# EasyEDA Pro project ProProject_Paragliding-Sensor_2023-10-07.epro

# Schematic Schematic
Create Date: 2023-07-27; Page Name: Ext. Sensor; Project Name: Paragliding-Sensor; Schematic Name: Schematic; Update Date: 2023-09-18; Company: 嘉立创EDA; Page Size: A4; Version: V1.0
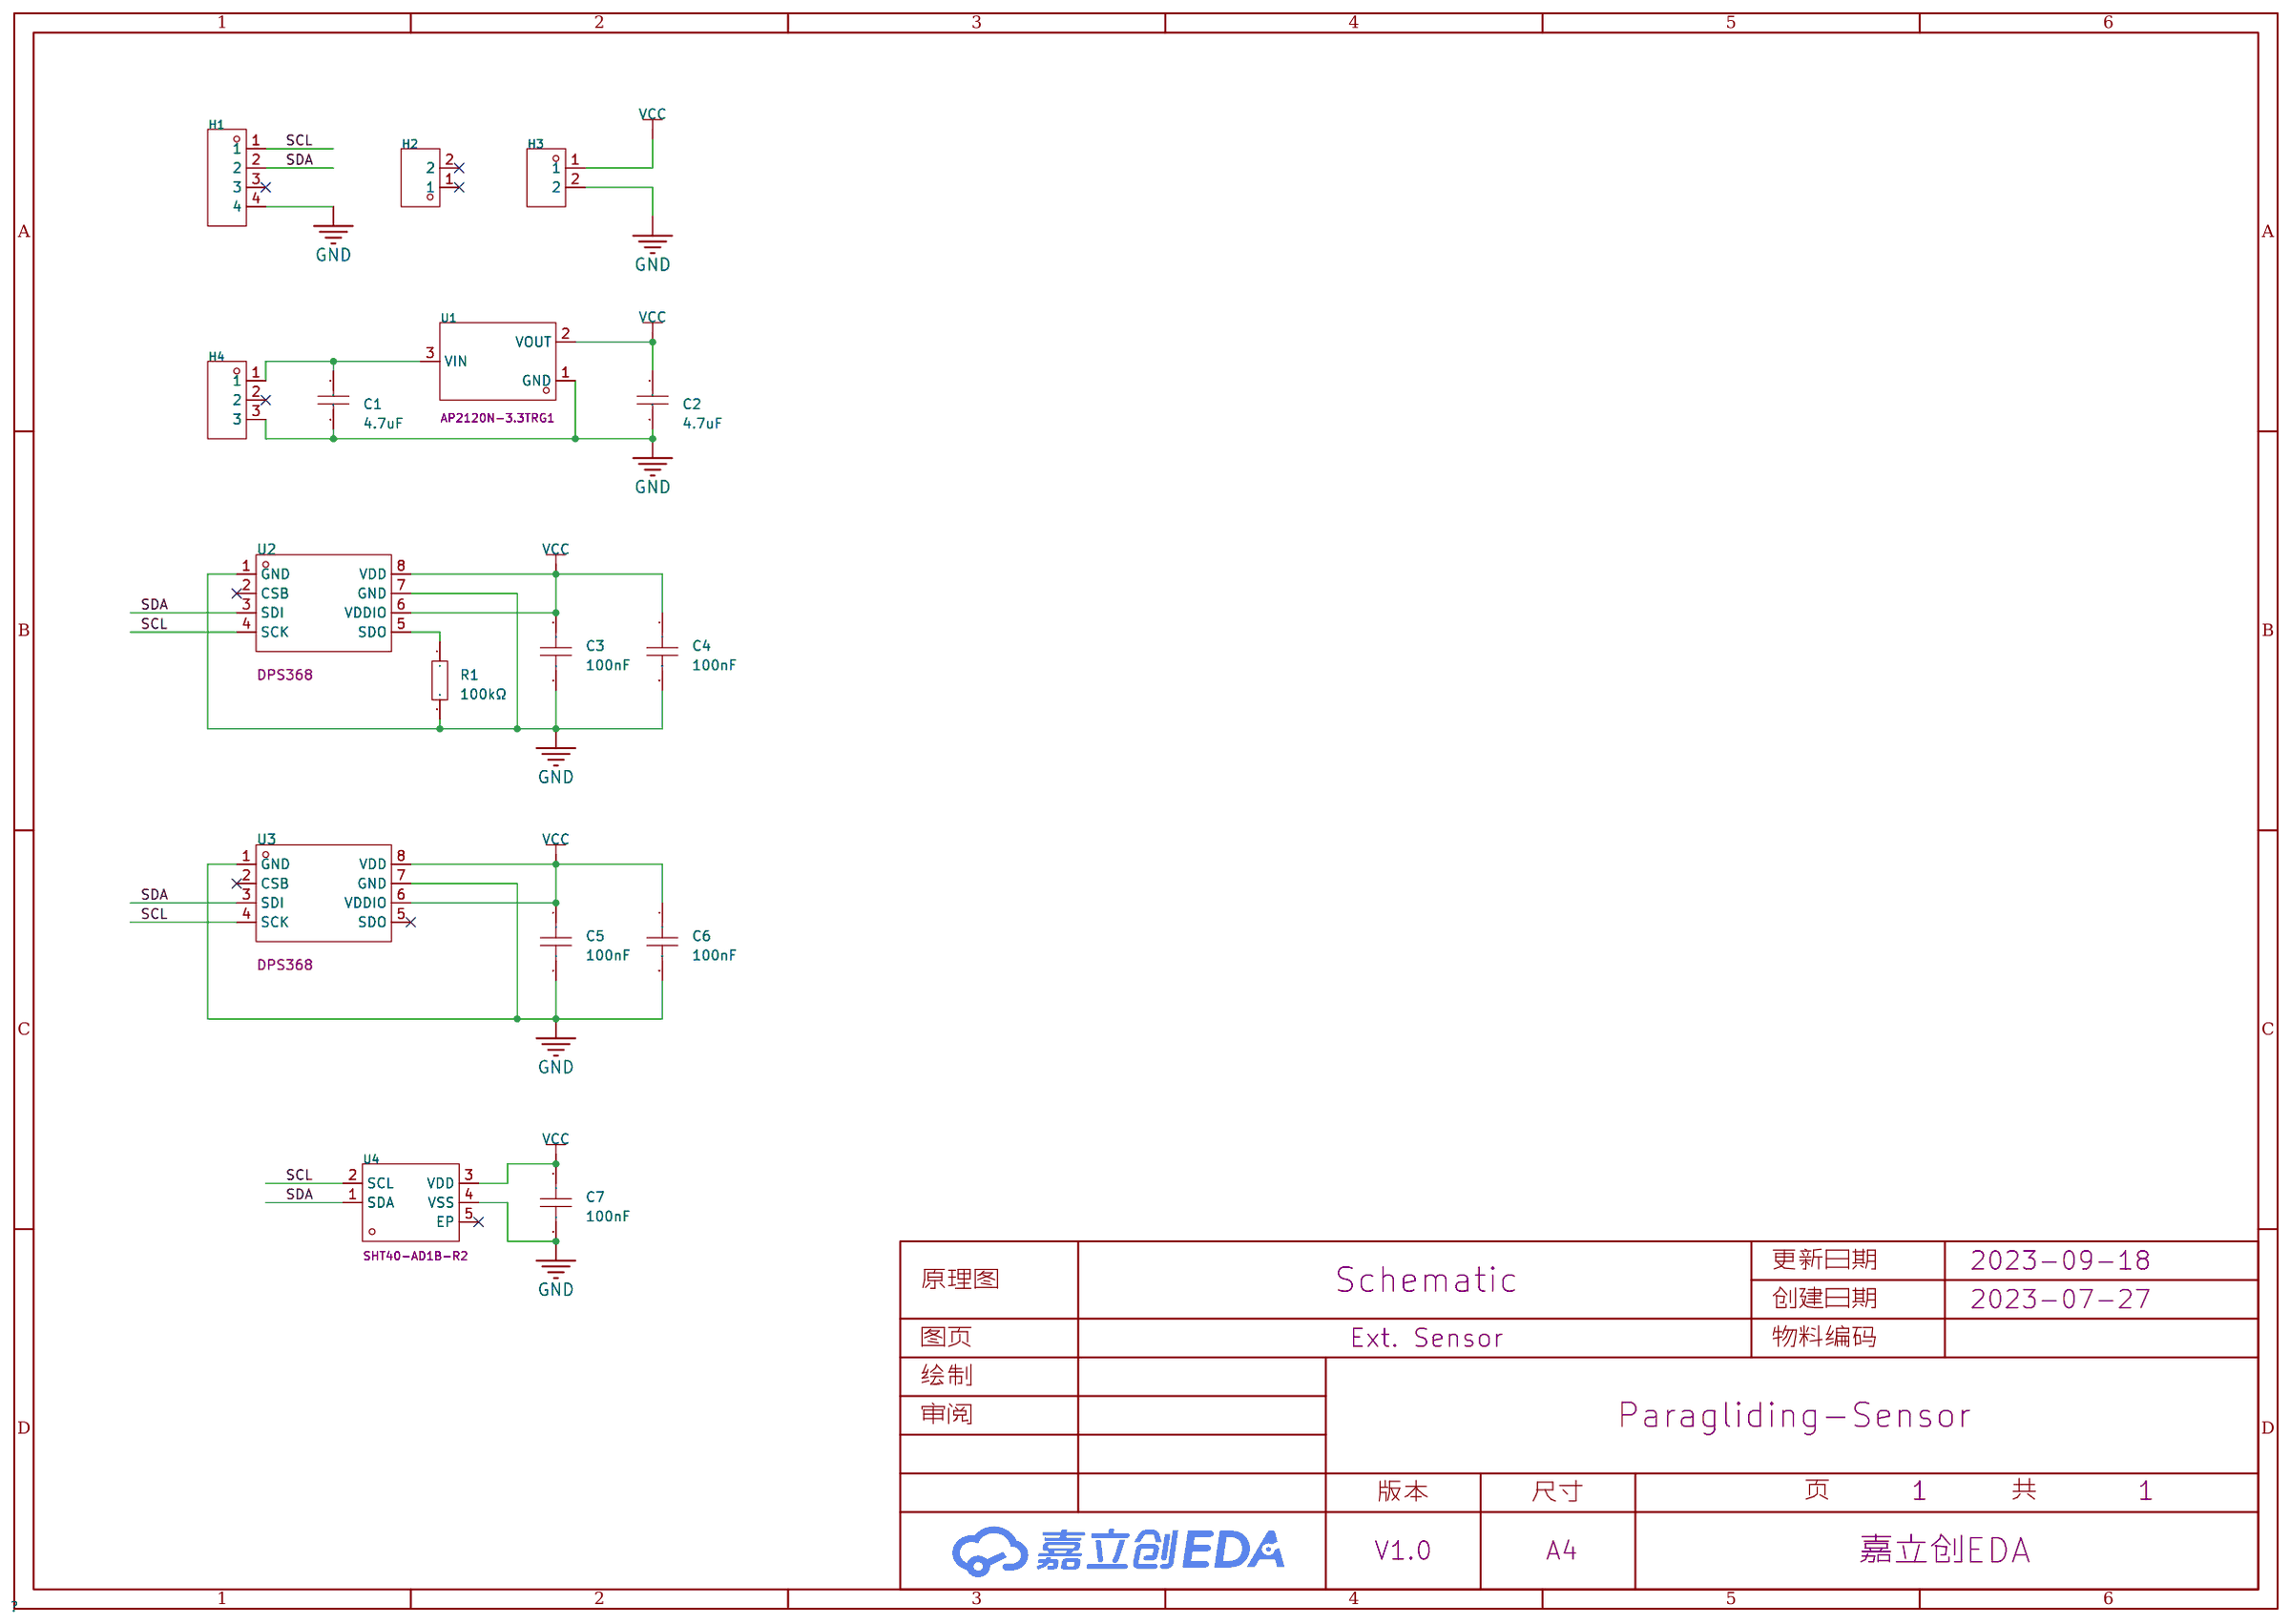
[diagram p0: schematic sheet]

## Parts
C1  4.7uF  [C0402]
C2  4.7uF  [C0402]
C3  100nF  [C0201]
C4  100nF  [C0201]
C5  100nF  [C0201]
C6  100nF  [C0201]
C7  100nF  [C0201]
H1  PZ254V-11-04P  [HDR-TH_4P-P2.54-V-M]
H2  PZ254V-11-02P  [HDR-TH_2P-P2.54-V-M]
H3  PZ254V-11-02P  [HDR-TH_2P-P2.54-V-M]
H4  PZ254V-11-03P  [HDR-TH_3P-P2.54-V-M]
R1  100kΩ  [R0201]
U1  AP2120N-3.3TRG1  [SOT-23-3_L2.9-W1.3-P1.90-LS2.4-BR]
U2  DPS368  [WLGA-8_L2.5-W2.0-P0.65-TR_DPS422]
U3  DPS368  [WLGA-8_L2.5-W2.0-P0.65-TR_DPS422]
U4  SHT40-AD1B-R2  [DFN-4_L1.5-W1.5-P0.8-TL-EP]

## Library data of the parts
C1 C2 = CL05A475MP5NRNC: 容值:4.7uF;精度:±20%;额定电压:10V;材质(温度系数):X5R;; LCSC Part Name: 4.7uF ±20% 10V; Supplier Part: C23733; Manufacturer: SAMSUNG(三星); Supplier Footprint: 0402; JLCPCB Part Class: 基础库; Datasheet: https://atta.szlcsc.com/upload/public/pdf/source/20160103/1457707710457.pdf; Supplier: LCSC; Tolerance: ±20%; Voltage Rated: 10V; Temperature Coefficient: X5R
C3-C7 = GRM033Z71A104KE14D: 容值:100nF;精度:±10%;额定电压:10V;材质(温度系数):X7R;; LCSC Part Name: 100nF ±10% 10V; Supplier Part: C161494; Manufacturer: muRata(村田); Supplier Footprint: 0201; JLCPCB Part Class: 扩展库; Datasheet: https://atta.szlcsc.com/upload/public/pdf/source/20181119/C161494_7C14CD1E604AF2690E90D16E0278156D.pdf; Supplier: LCSC; Tolerance: ±10%; Voltage Rated: 10V; Temperature Coefficient: X7R
H1 = PZ254V-11-04P: 排数:单排;总PIN位数:4P;间距:2.54mm;插针结构:1x4P;行距:-;安装类型:直插;圆针/方针:方针;额定电流:3A;额定电压:250V;配合针长度:6mm;塑高:2.5mm;端接针长度:3mm;触头材质:-;工作温度范围:-40℃~+105℃;颜色:黑色;; LCSC Part Name: 2.54mm 1x4P 直插 方针; Supplier Part: C2691448; Manufacturer: XFCN(兴飞); Supplier Footprint: 插件,P=2.54mm; JLCPCB Part Class: 扩展库; Datasheet: https://atta.szlcsc.com/upload/public/pdf/source/20200309/C492403_F9F19131791D08044AD4F84F8E751A34.pdf; Supplier: LCSC; Number of Rows: 单排; Number of Pins: 4P; Pitch: 2.54mm; Pin Structure: 1x4P; Mounting Type: 直插; Circluar Pins/Square Pins: 方针; Current Rating (Max): 3A; Voltage Rating (Max): 250V; Length of Mating Pin: 6mm; Insulation Height: 2.5mm; Length of End Connection Pin: 3mm; Operating Temperature Range: -40℃~+105℃; Color: 黑色
H2 H3 = PZ254V-11-02P: 排数:单排;总PIN位数:2P;间距:2.54mm;插针结构:1x2P;行距:-;安装类型:直插;圆针/方针:方针;额定电流:-;额定电压:-;配合针长度:6mm;塑高:2.5mm;端接针长度:3mm;触头材质:黄铜;触头镀层:-;工作温度范围:-40℃~+105℃;颜色:黑色;; LCSC Part Name: 2.54mm 1x2P 直插 方针; Supplier Part: C492401; Manufacturer: XFCN(兴飞); Supplier Footprint: 插件,P=2.54mm; JLCPCB Part Class: 扩展库; Datasheet: https://atta.szlcsc.com/upload/public/pdf/source/20200309/C492401_A812433581A9B211A7FFA413ADDFF0E5.pdf; Supplier: LCSC; Number of Rows: 单排; Number of Pins: 2P; Pitch: 2.54mm; Pin Structure: 1x2P; Mounting Type: 直插; Circluar Pins/Square Pins: 方针; Length of Mating Pin: 6mm; Insulation Height: 2.5mm; Length of End Connection Pin: 3mm; Contact Material: 黄铜; Operating Temperature Range: -40℃~+105℃; Color: 黑色
H4 = PZ254V-11-03P: 排数:单排;总PIN位数:3;间距:2.54mm;插针结构:1x3P;行距:-;安装类型:直插;圆针/方针:方针;额定电流:3A;额定电压:250V;配合针长度:6mm;塑高:2.5mm;端接针长度:3mm;工作温度范围:-40℃~+105℃;颜色:黑色;; LCSC Part Name: 2.54mm 1x3P 直插 方针; Supplier Part: C2937625; Manufacturer: XFCN(兴飞); Supplier Footprint: 直插,P=2.54mm; JLCPCB Part Class: 扩展库; Datasheet: 2022-07-12/581362A/62b9d00620994b3696be7eb4af85ad72/双排排针和单排排针.pdf; Supplier: LCSC; Number of Rows: 单排; Number of Pins: 3; Pitch: 2.54mm; Pin Structure: 1x3P; Mounting Type: 直插; Circluar Pins/Square Pins: 方针; Current Rating (Max): 3A; Voltage Rating (Max): 250V; Length of Mating Pin: 6mm; Insulation Height: 2.5mm; Length of End Connection Pin: 3mm; Operating Temperature Range: -40℃~+105℃; Color: 黑色
R1 = 0201WMF1003TEE: 电阻类型:厚膜电阻;阻值:100kΩ;精度:±1%;功率:50mW;; LCSC Part Name: 100kΩ ±1% 50mW; Supplier Part: C270364; Manufacturer: UNI-ROYAL(厚声); Supplier Footprint: 0201; JLCPCB Part Class: 扩展库; Datasheet: https://atta.szlcsc.com/upload/public/pdf/source/20200306/C422600_1E6D84923E4A46A82E41ADD87F860B5C.pdf; Supplier: LCSC; Type: 厚膜电阻; Tolerance: ±1%; Power(Watts): 50mW; Temperature Coefficient: ±200ppm/℃; Overload Voltage (Max): 25V; Operating Temperature Range: -55℃~+155℃
U1 = AP2120N-3.3TRG1: 输出类型:固定;输出极性:正;最大输入电压:6V;输出电压:3.3V;输出电流:150mA;电源纹波抑制比(PSRR):65dB@(1kHz);; LCSC Part Name: 输入6V 输出3.3V 150mA; Supplier Part: C156330; Manufacturer: DIODES(美台); Supplier Footprint: SOT-23; JLCPCB Part Class: 扩展库; Datasheet: https://atta.szlcsc.com/upload/public/pdf/source/20180307/C156330_15204110207831407988.pdf; Supplier: LCSC; Output Type: 固定; Output Polarity: 正; Number of Outputs: 1; Maximum Input Voltage: 6V; Output Voltage: 3.3V; Dropout Voltage: 500mV@(150mA); Quiescent Current (Ground Current): 50uA; Output Current: 150mA; Power Supply Rejection Ratio (PSRR): 65dB@(1kHz); Operating Temperature: -40℃~+85℃
U2 U3 = DPS368: Supplier Part: C535115; Manufacturer: Infineon(英飞凌); Supplier Footprint: VLGA-8(2x2.5); JLCPCB Part Class: 扩展库; Datasheet: https://atta.szlcsc.com/upload/public/pdf/source/20220812/DD997228859A2E6B5BE01B3E0ED58C18.pdf; Supplier: LCSC
U4 = SHT40-AD1B-R2: Latest relative humidity and temperature sensor generation: SHT4x, 2.5k TR size, RH/ T Sensor; LCSC Part Name: 3.000.465; Supplier Part: C2909890; Manufacturer: Sensirion(瑞士盛思锐); Supplier Footprint: DFN-4-EP(1.5x1.5); JLCPCB Part Class: 扩展库; Datasheet: https://atta.szlcsc.com/upload/public/pdf/source/20211021/851BA36A5CA574D725310F52CADA4510.pdf; Supplier: LCSC

## Nets
GND: C1.2 C2.2 C3.2 C4.2 C5.2 C6.2 C7.2 H1.4 H3.2 H4.3 R1.2 U1.1(GND) U2.1(GND) U2.7(GND) U3.1(GND) U3.7(GND) U4.4(VSS)
VCC: C2.1 C3.1 C4.1 C5.1 C6.1 C7.1 H3.1 U1.2(VOUT) U2.6(VDDIO) U2.8(VDD) U3.6(VDDIO) U3.8(VDD) U4.3(VDD)
SCL: H1.1 U2.4(SCK) U3.4(SCK) U4.2(SCL)
SDA: H1.2 U2.3(SDI) U3.3(SDI) U4.1(SDA)
$1N4867: R1.1 U2.5(SDO)
$1N7860: C1.1 H4.1 U1.3(VIN)

Not connected (* = marked no-connect by the designer): H1 3*; H2 1* 2*; H4 2*; U2 2(CSB)*; U3 2(CSB)* 5(SDO)*; U4 5(EP)*

# Board PCB
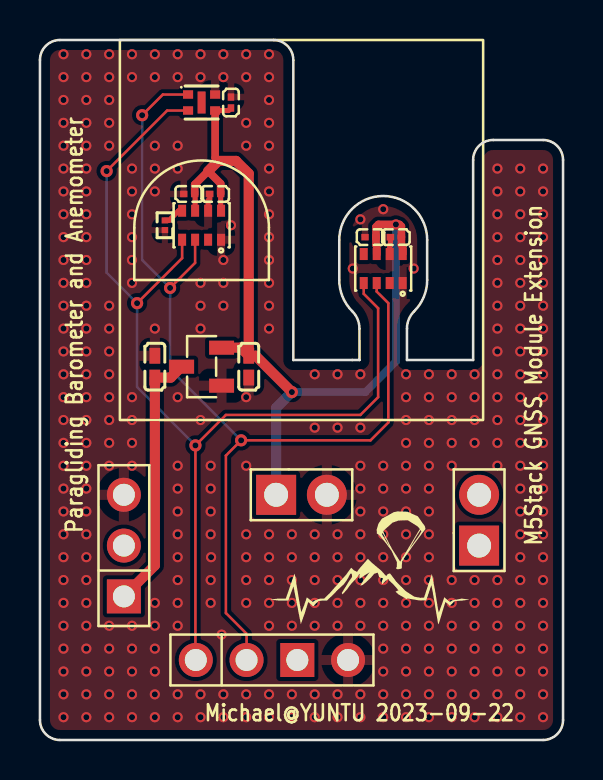
[diagram p1: board, top side]
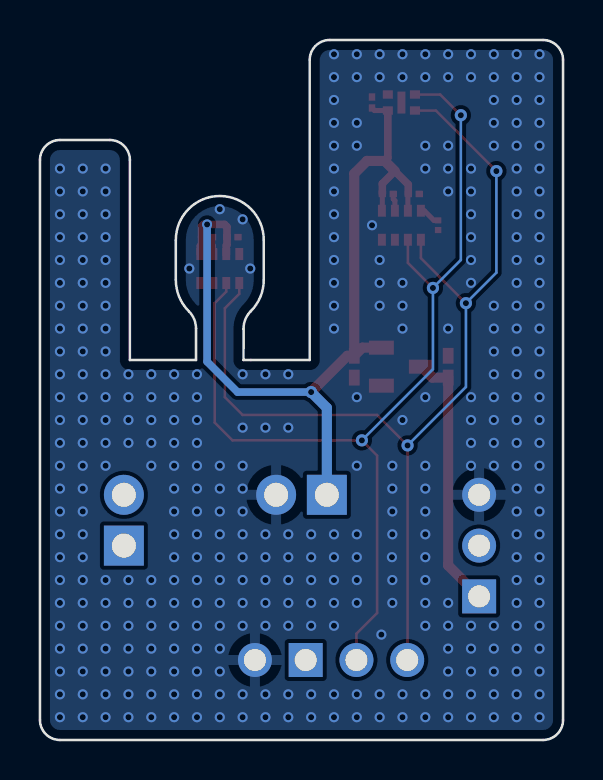
[diagram p2: board, bottom side, seen from below]

Outline 26.18 x 35 mm; copper layers: Top Layer, Bottom Layer. Coordinates in mm from the lower left corner of the outline.
Outline path: 0,34 0,1 arc(0.29,0.29) 1,0 25.18,0 arc(25.89,0.29) 26.18,1 26.18,29 arc(25.89,29.71) 25.18,30 22.68,30 arc(21.97,29.71) 21.68,29 21.68,19 18.37,19 18.37,20.57 arc(18.46,21.04) 18.73,21.44 arc(19.21,22.16) 19.38,23 19.38,25 arc(17.18,27.2) 14.98,25 14.98,23 arc(15.15,22.16) 15.63,21.44 arc(15.9,21.04) 15.99,20.57 15.99,19 12.68,19 12.68,34 arc(12.39,34.71) 11.68,35 1,35 arc(0.29,34.71) 0,34
Stack: Top Layer 0.035mm / Dielectric1 1.51mm FR4 er 4.5 / Bottom Layer 0.035mm

## Design rules (mm)
template: 自定义配置
spacing copperThickness1oz (default): track to track 0.102, other pairs 0.152 to 0.3
spacing copperThickness2oz: track to track 0.203, other pairs 0.152 to 0.3
track width copperThickness1oz (default): min 0.127, default 0.254, max 2.54
track width copperThickness2oz: min 0.203, default 0.254, max 2.54
differential pair differentialPair (default): width min 0.127, default 0.254, max 2.54; gap min 0.152, default 0.152
via viaSize (default): diameter min 0.5, default 0.61, max 10; hole min 0.3, default 0.305, max 6.3

## Placement (name value [footprint] x y rotation side)
C1  4.7uF  [C0402]  5.75 18.67 90 top
C2  4.7uF  [C0402]  10.45 18.67 270 top
C3  100nF  [C0201]  16.55 25.14 180 top
C4  100nF  [C0201]  17.81 25.14 180 top
C5  100nF  [C0201]  7.47 27.3 180 top
C6  100nF  [C0201]  8.77 27.3 180 top
C7  100nF  [C0201]  9.56 31.87 90 top
H1  PZ254V-11-04P  [HDR-TH_4P-P2.54-V-M]  11.61 4 0 top
H2  PZ254V-11-02P  [HDR-TH_2P-P2.54-V-M]  21.98 10.99 90 top
H3  PZ254V-11-02P  [HDR-TH_2P-P2.54-V-M]  13.09 12.26 0 top
H4  PZ254V-11-03P  [HDR-TH_3P-P2.54-V-M]  4.2 9.72 90 top
R1  100kΩ  [R0201]  6.25 25.74 270 top
U1  AP2120N-3.3TRG1  [SOT-23-3_L2.9-W1.3-P1.90-LS2.4-BR]  8.09 18.67 0 top
U2  DPS368  [WLGA-8_L2.5-W2.0-P0.65-TR_DPS422]  8.09 25.74 270 top
U3  DPS368  [WLGA-8_L2.5-W2.0-P0.65-TR_DPS422]  17.18 23.57 270 top
U4  SHT40-AD1B-R2  [DFN-4_L1.5-W1.5-P0.8-TL-EP]  8.09 31.87 0 top

## Footprints (pads in the part's own frame, mm; a bottom-side part is the same pattern mirrored in y, then rotated)
C0201
  rect 0.368x0.324 smd: 1(-0.275,0) 2(0.275,0)
C0402
  rect 0.79x0.54 smd: 1(-0.545,0) 2(0.545,0)
DFN-4_L1.5-W1.5-P0.8-TL-EP
  rect 0.505x0.42 smd: 1(-0.677,0.4) 2(-0.677,-0.4) 3(0.677,-0.4) 4(0.677,0.4)
  rect 0.4x1.1 smd: 5(0,0)
HDR-TH_2P-P2.54-V-M
  rect 2x2 hole 1.2: 1(-1.27,0)
  round 2 hole 1.2: 2(1.27,0)
HDR-TH_3P-P2.54-V-M
  rect 1.7x1.7 hole 1.1: 1(-2.54,0)
  round 1.7 hole 1.1: 2(0,0) 3(2.54,0)
HDR-TH_4P-P2.54-V-M
  round 1.7 hole 1.1: 1(-3.81,0) 2(-1.27,0) 4(3.81,0)
  rect 1.7x1.7 hole 1.1: 3(1.27,0)
R0201
  rect 0.303x0.324 smd: 1(-0.241,0) 2(0.241,0)
SOT-23-3_L2.9-W1.3-P1.90-LS2.4-BR
  rect 1.25x0.7 smd: 1(1,-0.95) 2(1,0.95) 3(-1,0)
WLGA-8_L2.5-W2.0-P0.65-TR_DPS422
  rect 0.6x0.4 smd: 1(0.725,0.975) 2(0.725,0.325) 3(0.725,-0.325) 4(0.725,-0.975) 5(-0.725,-0.975) 6(-0.725,-0.325) 7(-0.725,0.325) 8(-0.725,0.975)

## Nets
As in the schematic.

Pads without a net: H1 3; H2 1 2; H4 2; U2 2; U3 2 5; U4 5

## Via types
v1: diameter 0.508, hole 0.305, Top Layer to Bottom Layer, 358 vias
v2: diameter 0.61, hole 0.305, Top Layer to Bottom Layer, 7 vias

## Routing (per net, layer and track width the routed paths; a pad name or vN(x,y) marks a point on that pad's centre or on a via; arc(x,y) is an arc through that point)
GND: length 1.7
  Top Layer w0.254: C6.2 8.5,27.05 8.42,26.97 8.42,26.46 ; C4.2 17.54,24.76 17.5,24.73 U3.7
  vias: v1(1.18,34.29) v1(1.18,33.14) v1(1.18,32) v1(1.18,30.86) v1(1.18,29.72) v1(1.18,28.57) v1(1.18,27.43) v1(1.18,26.29) v1(1.18,25.14) v1(1.18,24) v1(1.18,22.86) v1(1.18,21.71) v1(1.18,20.57) v1(1.18,19.43) v1(1.18,18.28) v1(1.18,17.14) v1(1.18,16) v1(1.18,14.86) v1(1.18,13.71) v1(1.18,12.57) v1(1.18,11.43) v1(1.18,10.28) v1(1.18,9.14) v1(1.18,8) v1(1.18,6.86) v1(1.18,5.71) v1(1.18,4.57) v1(1.18,3.43) v1(1.18,2.28) v1(1.18,1.14) v1(2.32,34.29) v1(2.32,33.14) v1(2.32,32) v1(2.32,30.86) v1(2.32,29.72) v1(2.32,28.57) v1(2.32,27.43) v1(2.32,26.29) v1(2.32,25.14) v1(2.32,24) v1(2.32,22.86) v1(2.32,21.71) v1(2.32,20.57) v1(2.32,19.43) v1(2.32,18.28) v1(2.32,17.14) v1(2.32,16) v1(2.32,14.86) v1(2.32,13.71) v1(2.32,12.57) v1(2.32,11.43) v1(2.32,10.28) v1(2.32,9.14) v1(2.32,8) v1(2.32,6.86) v1(2.32,5.71) v1(2.32,4.57) v1(2.32,3.43) v1(2.32,2.28) v1(2.32,1.14) v1(3.46,34.29) v1(3.46,33.14) v1(3.46,32) v1(3.46,30.86) v1(3.46,29.72) v1(3.46,21.71) v1(3.46,20.57) v1(3.46,19.43) v1(3.46,18.28) v1(3.46,17.14) v1(3.46,16) v1(3.46,14.86) v1(3.46,13.71) v1(3.46,5.71) v1(3.46,4.57) v1(3.46,3.43) v1(3.46,2.28) v1(3.46,1.14) v1(4.61,34.29) v1(4.61,33.14) v1(4.61,28.57) v1(4.61,27.43) v1(4.61,26.29) v1(4.61,25.14) v1(4.61,24) v1(4.61,22.86) v1(4.61,17.14) v1(4.61,16) v1(4.61,14.86) v1(4.61,13.71) v1(4.61,5.71) v1(4.61,4.57) v1(4.61,3.43) v1(4.61,2.28) v1(4.61,1.14) v1(5.75,34.29) v1(5.75,33.14) v1(5.75,29.72) v1(5.75,28.57) v1(5.75,27.43) v1(5.75,20.57) v1(5.75,6.86) v1(5.75,5.71) v1(5.75,4.57) v1(5.75,3.43) v1(5.75,2.28) v1(5.75,1.14) v1(6.89,34.29) v1(6.89,33.14) v1(6.89,29.72) v1(6.89,28.57) v1(6.89,17.14) v1(6.89,13.71) v1(6.89,12.57) v1(6.89,11.43) v1(6.89,10.28) v1(6.89,9.14) v1(6.89,8) v1(6.89,6.86) v1(6.89,5.71) v1(6.89,2.28) v1(6.89,1.14) v1(8.04,34.29) v1(8.04,33.14) v1(8.04,22.86) v1(8.04,21.71) v1(8.04,20.57) v1(8.04,16) v1(8.04,2.28) v1(8.04,1.14) v1(8.54,13.71) v1(8.54,12.57) v1(8.54,11.43) v1(8.54,10.28) v1(8.56,9.14) v1(8.54,8) v1(8.54,6.86) v1(9.09,5.27) v1(9.18,34.29) v1(9.18,33.14) v1(9.18,24) v1(9.18,22.86) v1(9.18,21.71) v1(9.18,2.28) v1(9.18,1.14) v1(9.56,25.74) v1(10.32,34.29) v1(10.32,33.14) v1(10.32,30.86) v1(10.32,29.72) v1(10.32,17.14) v1(10.32,13.71) v1(10.32,10.28) v1(10.32,9.14) v1(10.32,8) v1(10.32,6.86) v1(10.32,2.28) v1(10.32,1.14) v1(11.47,34.29) v1(11.47,33.14) v1(11.47,32) v1(11.47,30.86) v1(11.47,29.72) v1(11.47,28.57) v1(11.47,27.43) v1(11.47,26.29) v1(11.47,25.14) v1(11.47,24) v1(11.47,22.86) v1(11.47,21.71) v1(11.47,20.57) v1(11.47,10.28) v1(11.47,9.14) v1(11.47,8) v1(11.47,6.86) v1(11.47,5.71) v1(11.47,2.28) v1(11.47,1.14) v1(12.61,10.28) v1(12.61,9.14) v1(12.61,8) v1(12.61,6.86) v1(12.61,5.71) v1(12.61,2.28) v1(12.61,1.14) v1(13.75,18.28) v1(13.75,15.62) v1(13.75,10.28) v1(13.75,9.14) v1(13.75,8) v1(13.75,6.86) v1(13.75,5.71) v1(13.75,2.28) v1(13.75,1.14) v1(14.89,18.28) v1(14.89,15.62) v1(14.89,10.28) v1(14.89,9.14) v1(14.89,8) v1(14.89,6.86) v1(14.89,5.71) v1(14.89,2.28) v1(14.89,1.14) v1(15.66,23.57) v1(16.04,26.03) v1(16.04,18.28) v1(16.04,15.62) v1(16.04,13.71) v1(16.04,12.57) v1(16.04,11.43) v1(16.04,10.28) v1(16.04,9.14) v1(16.04,8) v1(16.04,6.86) v1(16.04,5.71) v1(16.04,2.28) v1(16.04,1.14) v1(17.18,26.54) v1(17.18,13.71) v1(17.18,12.57) v1(17.18,11.43) v1(17.18,10.28) v1(17.18,9.14) v1(17.18,8) v1(17.18,6.86) v1(17.18,5.71) v1(17.18,4.57) v1(17.18,3.43) v1(17.18,2.28) v1(17.18,1.14) v1(18.32,18.28) v1(18.32,17.14) v1(18.32,16) v1(18.32,14.86) v1(18.32,13.71) v1(18.32,12.57) v1(18.32,11.43) v1(18.32,10.28) v1(18.32,9.14) v1(18.32,8) v1(18.32,6.86) v1(18.32,5.71) v1(18.32,4.57) v1(18.32,3.43) v1(18.32,2.28) v1(18.32,1.14) v1(18.7,23.57) v1(19.47,18.28) v1(19.47,17.14) v1(19.47,16) v1(19.47,14.86) v1(19.47,13.71) v1(19.47,12.57) v1(19.47,11.43) v1(19.47,10.28) v1(19.47,9.14) v1(19.47,8) v1(19.47,6.86) v1(19.47,5.71) v1(19.47,4.57) v1(19.47,3.43) v1(19.47,2.28) v1(19.47,1.14) v1(20.61,18.28) v1(20.61,17.14) v1(20.61,16) v1(20.61,14.86) v1(20.61,13.71) v1(20.61,8) v1(20.61,6.86) v1(20.61,5.71) v1(20.61,4.57) v1(20.61,3.43) v1(20.61,2.28) v1(20.61,1.14) v1(21.75,18.28) v1(21.75,17.14) v1(21.75,16) v1(21.75,14.86) v1(21.75,8) v1(21.75,6.86) v1(21.75,5.71) v1(21.75,4.57) v1(21.75,3.43) v1(21.75,2.28) v1(21.75,1.14) v1(22.9,28.57) v1(22.9,27.43) v1(22.9,26.29) v1(22.9,25.14) v1(22.9,24) v1(22.9,22.86) v1(22.9,21.71) v1(22.9,20.57) v1(22.9,19.43) v1(22.9,18.28) v1(22.9,17.14) v1(22.9,16) v1(22.9,14.86) v1(22.9,13.71) v1(22.9,8) v1(22.9,6.86) v1(22.9,5.71) v1(22.9,4.57) v1(22.9,3.43) v1(22.9,2.28) v1(22.9,1.14) v1(24.04,28.57) v1(24.04,27.43) v1(24.04,26.29) v1(24.04,25.14) v1(24.04,24) v1(24.04,22.86) v1(24.04,21.71) v1(24.04,20.57) v1(24.04,19.43) v1(24.04,18.28) v1(24.04,17.14) v1(24.04,16) v1(24.04,14.86) v1(24.04,13.71) v1(24.04,12.57) v1(24.04,11.43) v1(24.04,10.28) v1(24.04,9.14) v1(24.04,8) v1(24.04,6.86) v1(24.04,5.71) v1(24.04,4.57) v1(24.04,3.43) v1(24.04,2.28) v1(24.04,1.14) v1(25.18,28.57) v1(25.18,27.43) v1(25.18,26.29) v1(25.18,25.14) v1(25.18,24) v1(25.18,22.86) v1(25.18,21.71) v1(25.18,20.57) v1(25.18,19.43) v1(25.18,18.28) v1(25.18,17.14) v1(25.18,16) v1(25.18,14.86) v1(25.18,13.71) v1(25.18,12.57) v1(25.18,11.43) v1(25.18,10.28) v1(25.18,9.14) v1(25.18,8) v1(25.18,6.86) v1(25.18,5.71) v1(25.18,4.57) v1(25.18,3.43) v1(25.18,2.28) v1(25.18,1.14)
VCC: length 46.3
  Top Layer w0.254: C5.1 7.77,27.28 U2.6 ; U2.8 9.04,26.48 C6.1 ; C7.1 9.43,31.47 U4.3
  Top Layer w0.381: U3.8 18.16,24.7 18.09,24.76 C4.1 18.09,25.68 17.99,25.78 v1(17.81,25.78) 16.94,25.78 16.82,25.66 C3.1 16.82,24.76 16.86,24.73 U3.6 ; U4.3 8.77,29.11 8.93,28.95 ; C5.1 7.75,27.77 8.42,28.44 9.04,27.82 C6.1
  Top Layer w0.508: U1.2 10.04,19.62 C2.1 ; C2.1 10.79,19.21 v2(12.61,17.4) ; C2.1 10.45,28.32 9.81,28.95 8.93,28.95 8.42,28.44 ; 11.85,12.29 H3.1
  Bottom Layer w0.381: v2(12.61,17.4) 16.29,17.4 17.81,18.92 v1(17.81,25.78)
  Bottom Layer w0.508: H3.1 11.82,16.61 v2(12.61,17.4)
SCL: length 51.9
  Top Layer w0.127: v2(4.86,21.84) 7.12,24.09 U2.4 ; U3.4 16.21,22.31 16.93,21.59 16.93,17.14 16.04,16.25 9.31,16.25 v2(7.78,14.73) 7.78,4.02 H1.1 ; v2(3.34,28.44) 6.37,31.47 U4.2
  Bottom Layer w0.127: v2(7.78,14.73) 4.86,17.65 v2(4.86,21.84) 3.34,23.36 v2(3.34,28.44)
SDA: length 50.6
  Top Layer w0.127: U2.3 7.77,23.86 v2(6.51,22.6) ; U3.3 16.86,22.42 17.43,21.84 17.43,15.87 16.55,14.98 v2(10.07,14.98) 9.31,14.22 9.31,6.35 10.34,5.31 H1.2 ; v2(5.12,31.24) 6.15,32.27 7.41,32.27
  Bottom Layer w0.127: v2(5.12,31.24) 5.12,24 v2(6.51,22.6) 6.51,18.54 v2(10.07,14.98)
$1N4867: length 1.1
  Top Layer w0.254: R1.1 6.46,25.98 6.94,26.46 U2.5
$1N7860: length 13.1
  Top Layer w0.508: U1.3 6.55,18.12 C1.1 5.75,8.73 H4.1

## Copper pours and planes (outline as drawn; the poured copper is in the pictures)
GND on Top Layer: 0.03,34.92 26.2,34.92 26.2,0 0.03,0
GND on Bottom Layer: 0.03,34.92 26.2,34.92 26.2,0 0.03,0

## Text on the board
Top Silkscreen Layer: Michael@YUNTU 2023-09-22 | Paragliding Barometer and Anemometer | M5Stack GNSS Module Extension
